# EAGLE design v6 (EAGLE 7.3.0)

## Sheet 1 of 2
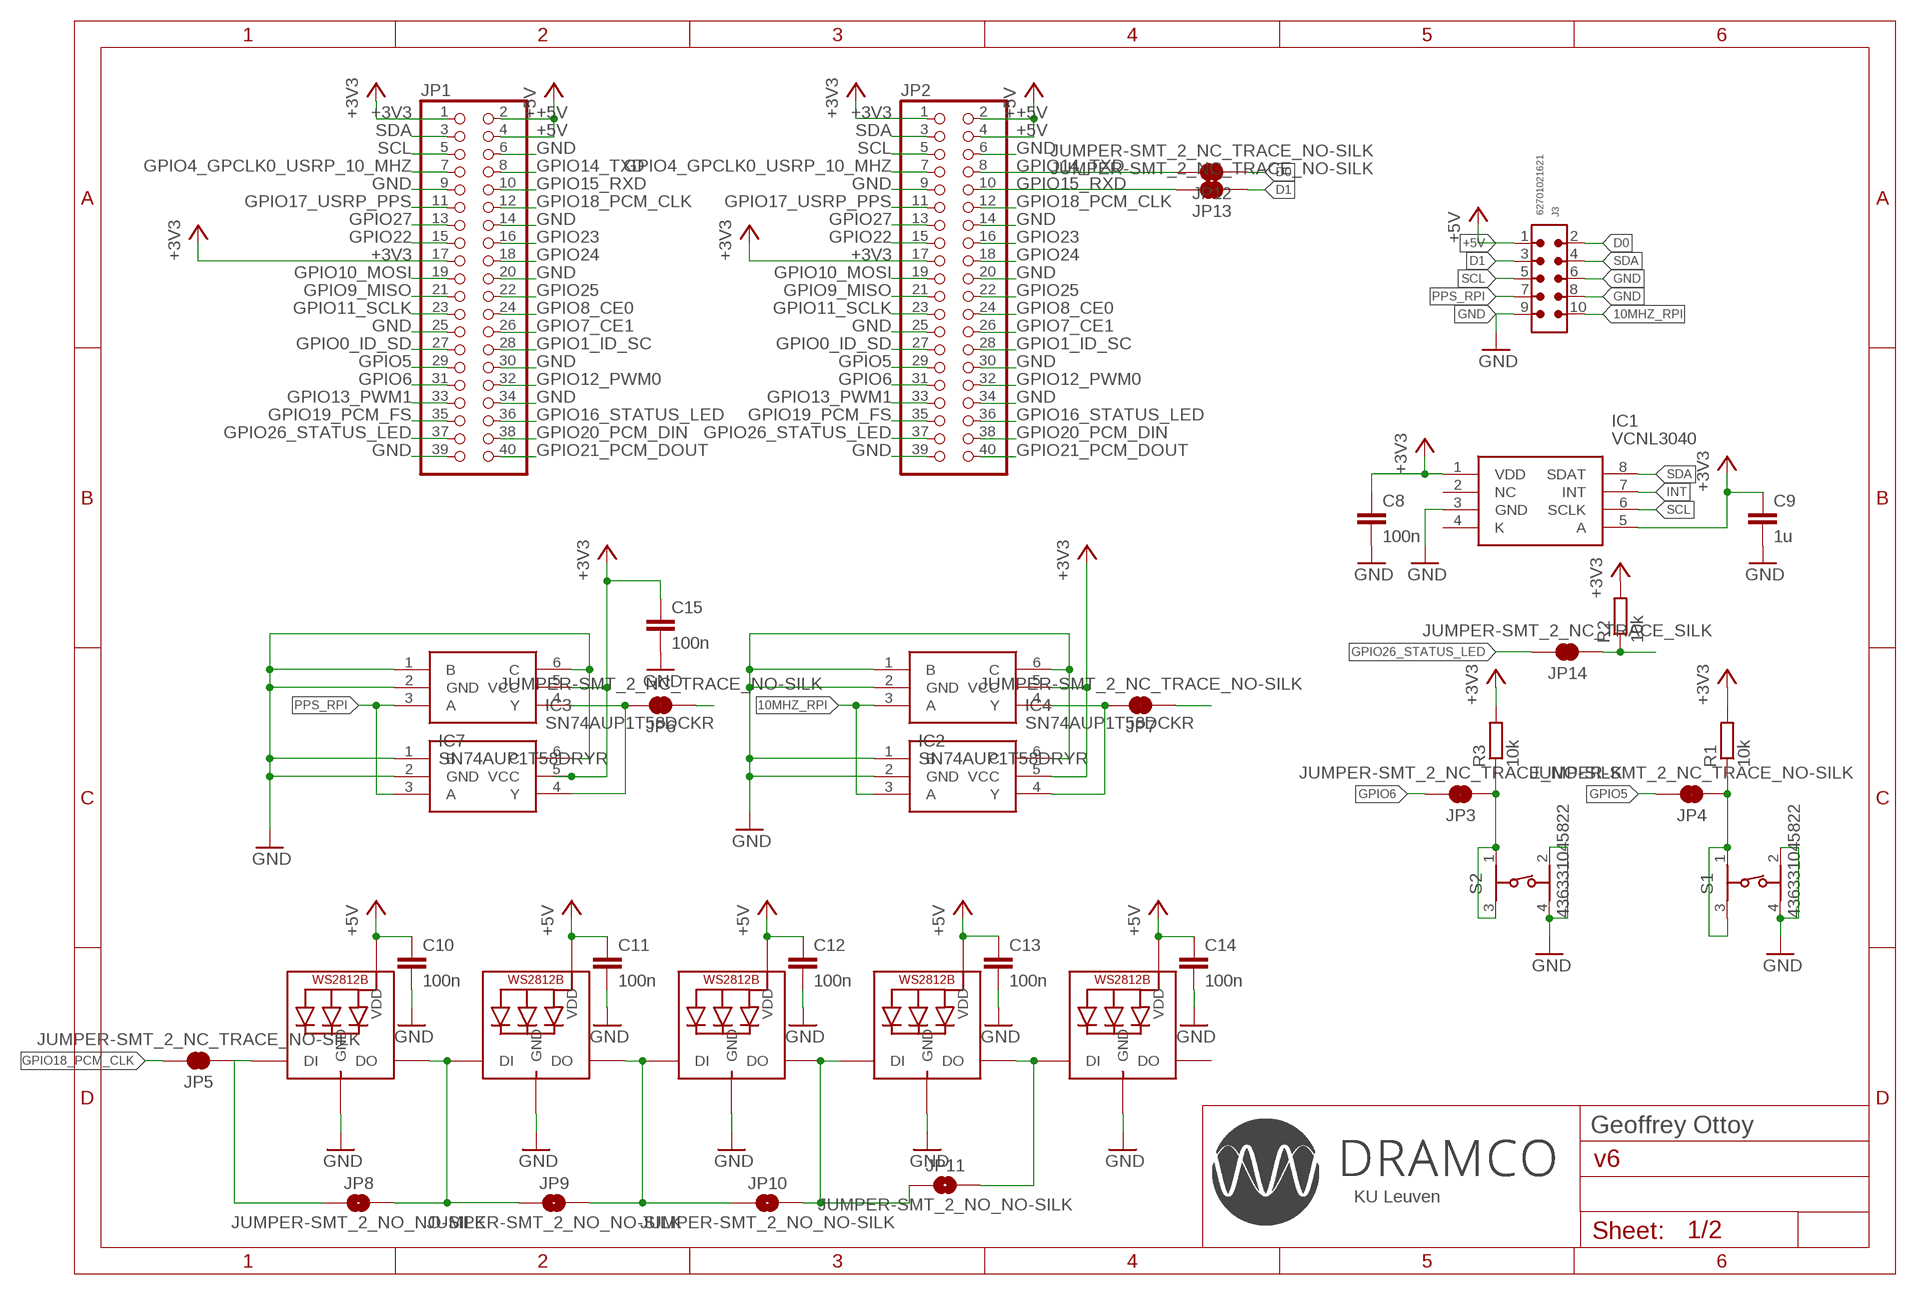
[diagram p0: schematic, sheet 1]

### Parts
C8  100n  C-EUC0603  [C0603]
C9  1u  C-EUC0603  [C0603]
C10  100n  C-EUC0603  [C0603]
C11  100n  C-EUC0603  [C0603]
C12  100n  C-EUC0603  [C0603]
C13  100n  C-EUC0603  [C0603]
C14  100n  C-EUC0603  [C0603]
C15  100n  C-EUC0603  [C0603]
IC1  VCNL3040  [SON108P200X400X115-8N]
IC2  SN74AUP1T58DRYR  [SON50P100X145X60-6N]
IC3  SN74AUP1T58DCKR  [SOT65P210X110-6N]
IC4  SN74AUP1T58DCKR  [SOT65P210X110-6N]
IC7  SN74AUP1T58DRYR  [SON50P100X145X60-6N]
J3  62701021621  6270XX21621_62701021621  [62701021621]
JP1  PINHD-2X20  [2X20]
JP2  PINHD-2X20/90  [2X20/90]
JP3  JUMPER-SMT_2_NC_TRACE_NO-SILK  [SMT-JUMPER_2_NC_TRACE_NO-SILK]
JP4  JUMPER-SMT_2_NC_TRACE_NO-SILK  [SMT-JUMPER_2_NC_TRACE_NO-SILK]
JP5  JUMPER-SMT_2_NC_TRACE_NO-SILK  [SMT-JUMPER_2_NC_TRACE_NO-SILK]
JP6  JUMPER-SMT_2_NC_TRACE_NO-SILK  [SMT-JUMPER_2_NC_TRACE_NO-SILK]
JP7  JUMPER-SMT_2_NC_TRACE_NO-SILK  [SMT-JUMPER_2_NC_TRACE_NO-SILK]
JP8  JUMPER-SMT_2_NO_NO-SILK  [SMT-JUMPER_2_NO_NO-SILK]
JP9  JUMPER-SMT_2_NO_NO-SILK  [SMT-JUMPER_2_NO_NO-SILK]
JP10  JUMPER-SMT_2_NO_NO-SILK  [SMT-JUMPER_2_NO_NO-SILK]
JP11  JUMPER-SMT_2_NO_NO-SILK  [SMT-JUMPER_2_NO_NO-SILK]
JP12  JUMPER-SMT_2_NC_TRACE_NO-SILK  [SMT-JUMPER_2_NC_TRACE_NO-SILK]
JP13  JUMPER-SMT_2_NC_TRACE_NO-SILK  [SMT-JUMPER_2_NC_TRACE_NO-SILK]
JP14  JUMPER-SMT_2_NC_TRACE_SILK  [SMT-JUMPER_2_NC_TRACE_SILK]
LED1  WS2812B5050  [WS2812B]
LED2  WS2812B5050  [WS2812B]
LED3  WS2812B5050  [WS2812B]
LED4  WS2812B5050  [WS2812B]
LED5  WS2812B5050  [WS2812B]
R1  10k  R-EU_R0603  [R0603]
R2  10k  R-EU_R0603  [R0603]
R3  10k  R-EU_R0603  [R0603]
S1  436331045822  [4363X10458XX]
S2  436331045822  [4363X10458XX]

### Nets
10MHZ_RPI: IC2.3(A) IC4.3(A) J3.10
+3V3: C8.1 C9.1 C15.1 IC1.1(VDD) IC1.5(A) IC2.5(VCC) IC3.5(VCC) IC4.5(VCC) IC7.5(VCC) JP1.1 JP1.17 JP2.1 JP2.17 R1.2 R2.2 R3.2
+5V: C10.1 C11.1 C12.1 C13.1 C14.1 J3.1 JP1.2 JP1.4 JP2.2 JP2.4 LED1.1-VDD(VDD) LED2.1-VDD(VDD) LED3.1-VDD(VDD) LED4.1-VDD(VDD) LED5.1-VDD(VDD)
D0: J3.2 JP12.1
D1: J3.3 JP13.1
GND: C8.2 C9.2 C10.2 C11.2 C12.2 C13.2 C14.2 C15.2 IC1.3(GND) IC2.1(B) IC2.2(GND) IC2.6(C) IC3.1(B) IC3.2(GND) IC3.6(C) IC4.1(B) IC4.2(GND) IC4.6(C) IC7.1(B) IC7.2(GND) IC7.6(C) J3.6 J3.8 J3.9 JP1.6 JP1.9 JP1.14 JP1.20 JP1.25 JP1.30 JP1.34 JP1.39 JP2.6 JP2.9 JP2.14 JP2.20 JP2.25 JP2.30 JP2.34 JP2.39 LED1.3-GND(GND) LED2.3-GND(GND) LED3.3-GND(GND) LED4.3-GND(GND) LED5.3-GND(GND) S1.2 S1.4 S2.2 S2.4 ; also sheet 2
GPIO0_ID_SD: JP1.27 JP2.27
GPIO1_ID_SC: JP1.28 JP2.28
GPIO4_GPCLK0_USRP_10_MHZ: JP1.7 JP2.7 JP7.1
GPIO5: JP1.29 JP2.29 JP4.2
GPIO6: JP1.31 JP2.31 JP3.2
GPIO7_CE1: JP1.26 JP2.26
GPIO8_CE0: JP1.24 JP2.24
GPIO9_MISO: JP1.21 JP2.21
GPIO10_MOSI: JP1.19 JP2.19
GPIO11_SCLK: JP1.23 JP2.23
GPIO12_PWM0: JP1.32 JP2.32
GPIO13_PWM1: JP1.33 JP2.33
GPIO14_TXD: JP1.8 JP2.8 JP12.2
GPIO15_RXD: JP1.10 JP2.10 JP13.2
GPIO16_STATUS_LED: JP1.36 JP2.36
GPIO17_USRP_PPS: JP1.11 JP2.11 JP6.1
GPIO18_PCM_CLK: JP1.12 JP2.12 JP5.2
GPIO19_PCM_FS: JP1.35 JP2.35
GPIO20_PCM_DIN: JP1.38 JP2.38
GPIO21_PCM_DOUT: JP1.40 JP2.40
GPIO22: JP1.15 JP2.15
GPIO23: JP1.16 JP2.16
GPIO24: JP1.18 JP2.18
GPIO25: JP1.22 JP2.22
GPIO26_STATUS_LED: JP1.37 JP2.37 JP14.2
GPIO27: JP1.13 JP2.13
INT: IC1.7(INT) JP14.1 R2.1
N$1: IC3.4(Y) IC7.4(Y) JP6.2
N$3: IC2.4(Y) IC4.4(Y) JP7.2
N$5: JP3.1 R3.1 S2.1 S2.3
N$6: JP8.2 JP9.1 LED1.2-DOUT(DO) LED2.4-DIN(DI)
N$7: JP9.2 JP10.1 LED2.2-DOUT(DO) LED3.4-DIN(DI)
N$8: JP10.2 JP11.1 LED3.2-DOUT(DO) LED4.4-DIN(DI)
N$9: JP11.2 LED4.2-DOUT(DO) LED5.4-DIN(DI)
N$10: JP4.1 R1.1 S1.1 S1.3
N$17: JP5.1 JP8.1 LED1.4-DIN(DI)
PPS_RPI: IC3.3(A) IC7.3(A) J3.7
SCL: IC1.6(SCLK) J3.5 JP1.5 JP2.5 ; also sheet 2
SDA: IC1.8(SDAT) J3.4 JP1.3 JP2.3 ; also sheet 2
Unconnected: IC1.2(NC) IC1.4(K) LED5.2-DOUT(DO)

### Notes on the sheet
- Geoffrey Ottoy
- KU Leuven

## Sheet 2 of 2
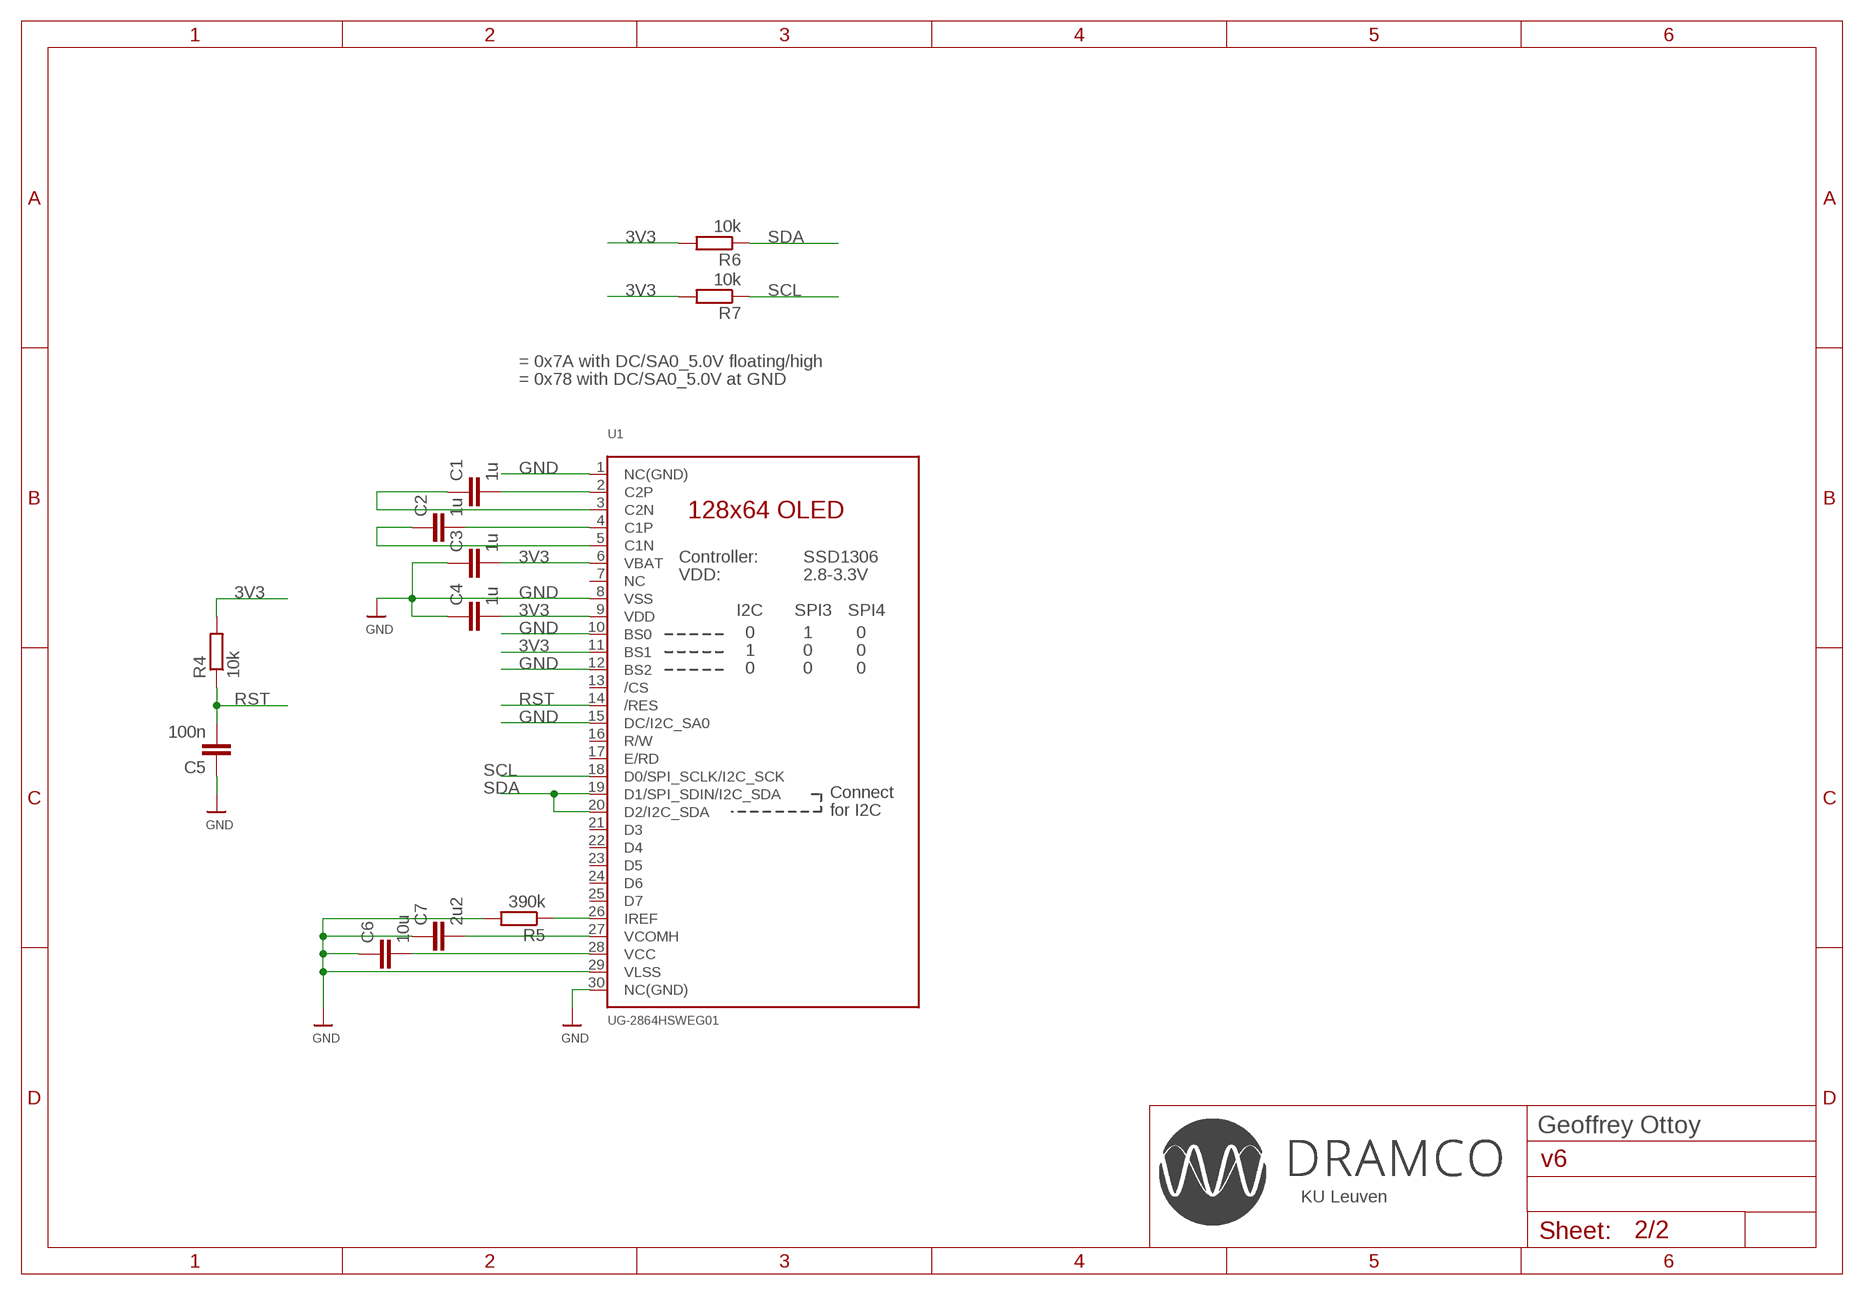
[diagram p1: schematic, sheet 2]

### Parts
C1  1u  C-EUC0603  [C0603]
C2  1u  C-EUC0603  [C0603]
C3  1u  C-EUC0603  [C0603]
C4  1u  C-EUC0603  [C0603]
C5  100n  C-EUC0603  [C0603]
C6  10u  C-EUC0603  [C0603]
C7  2u2  C-EUC0603  [C0603]
R4  10k  R-EU_R0603  [R0603]
R5  390k  R-EU_R0603  [R0603]
R6  10k  R-EU_R0603  [R0603]
R7  10k  R-EU_R0603  [R0603]
U1  UG-2864HSWEG01  DISP_OLED_UG-2864HSWEG010.96"  [UG-2864HSWEG01_0.96IN_WRAPAROUND]

### Nets
3V3: C3.2 C4.2 R4.2 R6.2 R7.2 U1.6(VBAT) U1.9(VDD) U1.11(BS1)
GND: C3.1 C4.1 C5.1 C6.1 C7.1 R5.2 U1.1(NC(GND)) U1.8(VSS) U1.10(BS0) U1.12(BS2) U1.15(DC/I2C_SA0) U1.29(VLSS) U1.30(NC(GND)) ; also sheet 1
N$11: C1.2 U1.2(C2P)
N$16: C6.2 U1.28(VCC)
N$19: C7.2 U1.27(VCOMH)
N$104: R5.1 U1.26(IREF)
N$112: C1.1 U1.3(C2N)
N$113: C2.2 U1.4(C1P)
N$114: C2.1 U1.5(C1N)
RST: C5.2 R4.1 U1.14(/RES)
SCL: R7.1 U1.18(D0/SPI_SCLK/I2C_SCK) ; also sheet 1
SDA: R6.1 U1.19(D1/SPI_SDIN/I2C_SDA) U1.20(D2/I2C_SDA) ; also sheet 1
Unconnected: U1.7(NC) U1.13(/CS) U1.16(R/W) U1.17(E/RD) U1.21(D3) U1.22(D4) U1.23(D5) U1.24(D6) U1.25(D7)

### Notes on the sheet
- = 0x7A with DC/SA0_5.0V floating/high
- = 0x78 with DC/SA0_5.0V at GND
- Geoffrey Ottoy
- KU Leuven

## Library data of the parts
C1-C15 = rcl:C-EU: CAPACITOR, European symbol
IC1 = SamacSys_Parts:VCNL3040: VISHAY - VCNL3040 - Proximity Sensor, I2C, 300 mm, QFN, 8 Pins, 2.5 V, 3.6 V Source: Datasheet; DESCRIPTION: VISHAY - VCNL3040 - Proximity Sensor, I2C, 300 mm, QFN, 8 Pins, 2.5 V, 3.6 V; HEIGHT: 1.15mm; MANUFACTURER_NAME: Vishay; MANUFACTURER_PART_NUMBER: VCNL3040; MOUSER_PART_NUMBER: 78-VCNL3040; MOUSER_PRICE-STOCK: https://www.mouser.co.uk/ProductDetail/Vishay-Semiconductors/VCNL3040?qs=bZr6mbWTK5m90GodUNdcvA%3D%3D
IC2 IC7 = SamacSys_Parts:SN74AUP1T58DRYR: SINGLE-SUPPLY VOLTAGE-LEVEL TRANSLATOR WITH NINE CONFIGURABLE GATE LOGIC FUNCTIONS Source: Datasheet <http://www.ti.com/lit/gpn/sn74aup1t58>; DESCRIPTION: SINGLE-SUPPLY VOLTAGE-LEVEL TRANSLATOR WITH NINE CONFIGURABLE GATE LOGIC FUNCTIONS; HEIGHT: mm; MANUFACTURER_NAME: Texas Instruments; MANUFACTURER_PART_NUMBER: SN74AUP1T58DRYR
IC3 IC4 = SamacSys_Parts:SN74AUP1T58DCKR: Single-Supply Voltage Translator Source: Datasheet <http://www.ti.com/lit/gpn/sn74aup1t58>; DESCRIPTION: Single-Supply Voltage Translator; HEIGHT: 1.1mm; MANUFACTURER_NAME: Texas Instruments; MANUFACTURER_PART_NUMBER: SN74AUP1T58DCKR
J3 = Eagle_WR-BHD (rev22c):6270XX21621_62701021621: WR-BHD 1.27 mm Male Box Header KIND PROPERTIES: Pitch 1.27 mm Gender:Male MATERIAL PROPERTIES: Insulator Material Nylon 9T Insulator Flammability Rating UL94 V-0 Insulator Color Black Contact Material Brass Contact Plating Gold over Nickel GENERAL INFORMATION: Operating Temperature -40 up to +105 °C Working Voltage 50 V (AC) Withstanding Voltage 500 V (AC) Contact Resistance 20 mΩ RISO 1000 MΩ CERTIFICATION: UL Approval E323964 <https://www.we-online.com/catalog/media/o375404v209%20Family_WR-BHD_6270xx21621.jpg> Details see: https://www.we-online.com/catalog/en/WR_BHD_1_27_MM_MALE_BOX_HEADER Created by Ella Wu 2021-08-24 2021 (C) Würth Elektronik; CONTACT-RESISTANCE: 20mOhm; DATASHEET-URL: https://www.we-online.com/redexpert/spec/62701021621?ae; GENDER: Male; IR: 1A; LENGTH: 12.7mm; MOUNT: THT; PART-NUMBER: 62701021621; PINS: 10; PITCH: 1.27mm; TYPE: Straight; WORKING-VOLTAGE: 50V(AC)
JP1 JP2 = pinhead:PINHD-2X20: PIN HEADER
JP3-JP7 JP12-JP14 = SparkFun-Jumpers:JUMPER-SMT_2_NC_TRACE: Normally closed trace jumper This jumper has a trace between two pads so it's normally closed (NC). Use a razor knife to open the connection. For best results follow the IPC guidelines for cutting traces: Cutout at least 0.063 mm (0.005 in). Remove all loose material to clean up the cut area. Seal the cut with an approved epoxy. Reapply solder to reclose the connection.
JP8-JP11 = SparkFun-Jumpers:JUMPER-SMT_2_NO: Normally open jumper This jumper has two pads in close proximity to each other. Apply solder to close the connection. Round pads are easier to solder for beginners, but are a lot larger. SparkFun Product that uses the round pads: SparkFun EL Sequencer <https://www.sparkfun.com/products/12781>
LED1-LED5 = adafruit:WS2812B
R1-R7 = rcl:R-EU_: RESISTOR, European symbol
S1 S2 = Eagle_WS-TASU (rev21a):436331045822: WS-TASU SMT Tact Switch with Boss Design 4.7x3.5 mm side push MATERIAL PROPERTIES Cover Material:Stainless Steel PROPERTIES Actuator Material:PA46 Actuator Flammability Rating: UL94 HB Actuator Color: Black; White Frame Material: PA46 Frame Flammability: UL94 HB Frame Color:Black;White Contact Material Stainless Steel Contact Plating Silver Terminal Material Copper Alloy Terminal Plating Silver VR 12 V (DC) Contact Resistance Initial 100 mΩ Contact Resistance After Life Test 1 Ω RISO 100 MΩ Withstanding Voltage 250 V (AC) Washable No Qty. 3300 Mechanical Properties Stroke:0.25 mm; 0.3 mm GENERAL INFORMATION Operating Temperature -40 up to +85 °C Washable:No PACKAGING PROPERTIES Packaging Tape and Reel <https://www.we-online.com/catalog/media/o61089v209%20Family_WS_TUS_Normal_SMD_J-Bend_4363x10458xx_pf2.jpg> Details see: https://www.we-online.com/catalog/en/TASU_3_5X4_7_SMD_SIDE_PUSH_BOSS_DESIGN/ Updated by Yingchun, Shan 2020-02-17 2020(C) Wurth Elektronik; DATASHEET-URL: https://www.we-online.com/catalog/datasheet/436331045822.pdf; H: 1.65mm; OPERATION-FORCE: 220g; PART-NUMBER: 436331045822; QTY: 3300
U1 = microbuilder:DISP_OLED_UG-2864HSWEG01: UG-2864HSWEG01 OLED display Both 1.3" and 0.96" models share the same FPC tab footprint, only the screen dimensions vary.

## Board
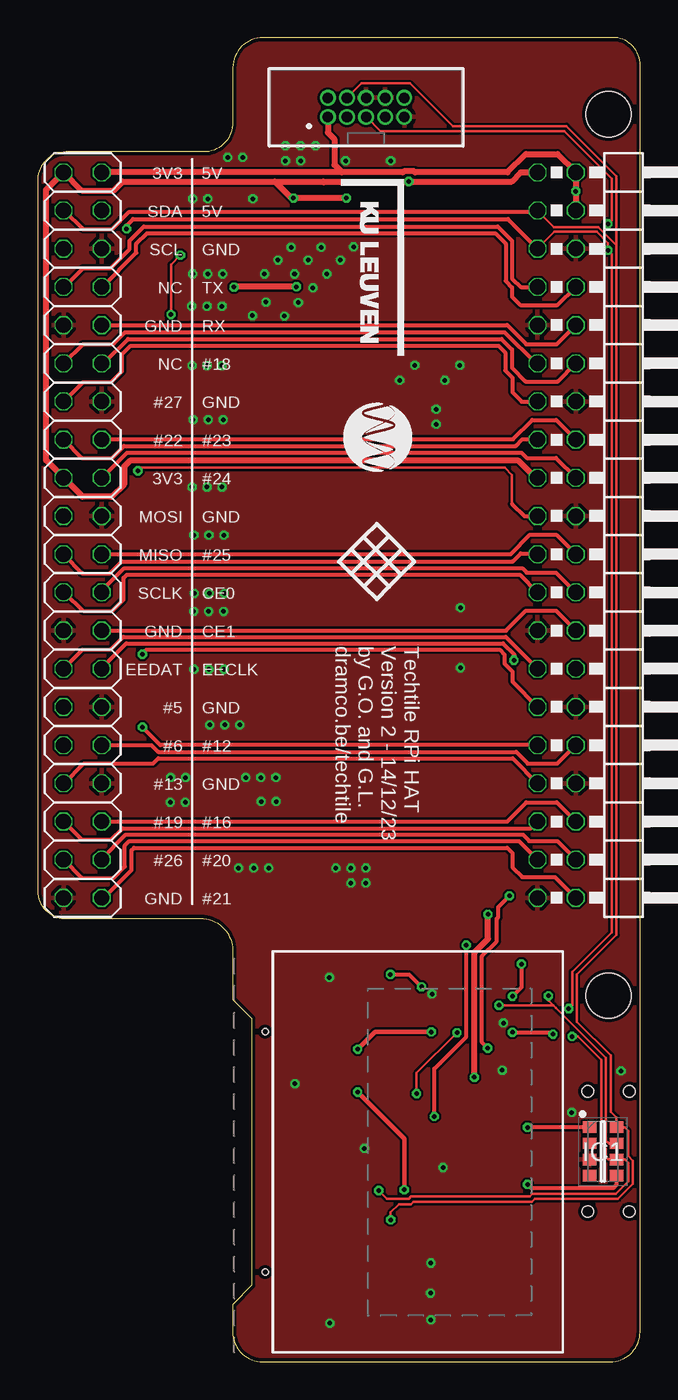
[diagram p2: board, top side]
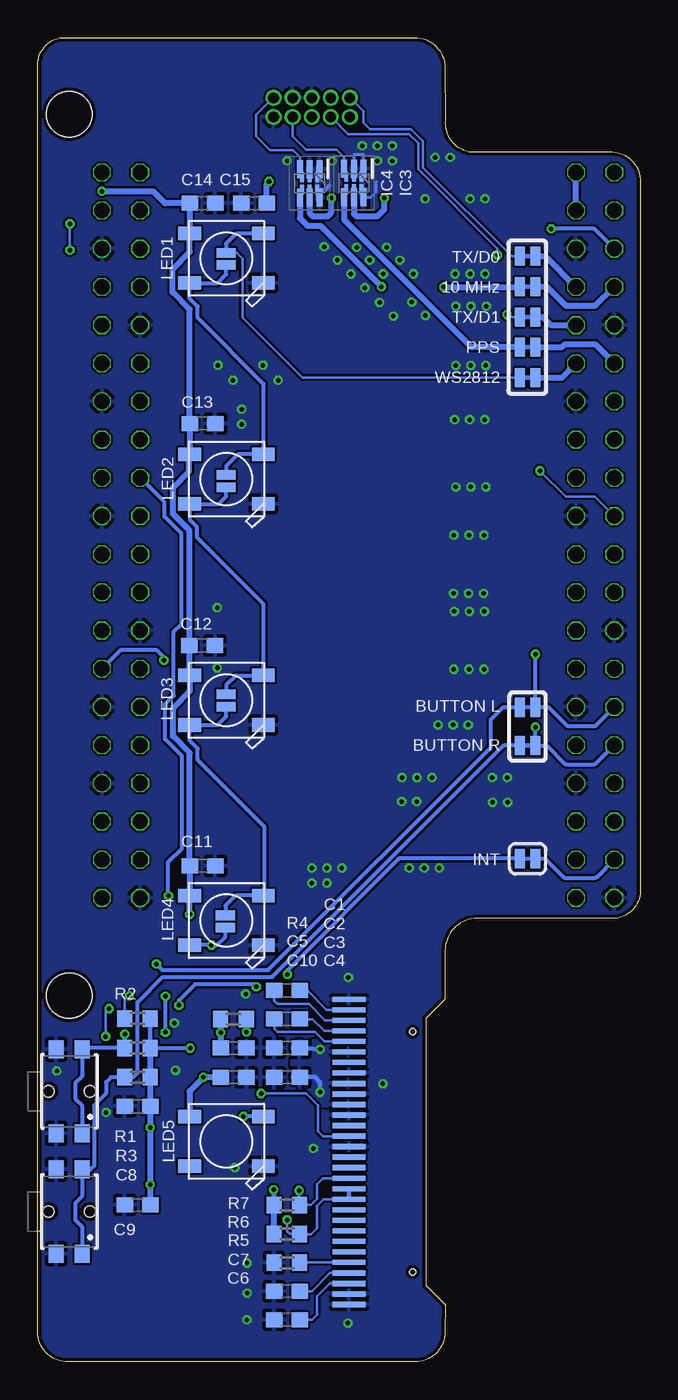
[diagram p3: board, bottom side, seen from below]

Size 40.1 x 88.09 mm. Coordinates in mm from the lower left corner, seen from the top.
Outline: 0,31.13 arc90 2.13,29.51 10.84,29.51 arc-90 12.98,27.36 12.98,24.13 14.26,22.84 14.26,5.09 12.97,3.81 12.98,2 arc90 14.98,0 38.09,0 arc90 40.09,2 40.09,86.09 arc90 38.46,88.09 15.01,88.09 arc89 12.98,86.09 12.97,82.64 12.97,82.62 arc-90 11.22,80.49 1.87,80.49 arc91 0,78.5 0,31.13
Copper layers (1*16): Top 0.035mm / dielectric 1.5mm / Bottom 0.035mm
Design rules "SeeedStudio_2layer_DRU_no_angle_20140221 *": minimum track width 6mil, minimum drill 12mil, track to track 6mil, track to pad 6mil, pad to pad 6mil, via to via 6mil, smd to smd 0mil, copper to edge 10mil, drill to drill 10mil, minimum pad ring 1mil, minimum via ring 6mil, stop-mask expansion 2mil, vias tented up to drill 100mil, thermal gap 10mil
Holes 3 mm at 38,83 38,24.36

### Footprints (pad centres in the part's own frame; a part is rotated, then mirrored left to right if it is on the bottom)
C0603 = smd 1.1 x 1: 1 -0.85,0; 2 0.85,0
SON108P200X400X115-8N = smd 0.9 x 0.75: 1 -0.9,1.612; 2 -0.9,0.538; 3 -0.9,-0.538; 4 -0.9,-1.612; 5 0.9,-1.612; 6 0.9,-0.538; 7 0.9,0.538; 8 0.9,1.612
SON50P100X145X60-6N = smd 0.66 x 0.254: 1 -0.406,0.508; 2 -0.406,0; 3 -0.406,-0.508; 4 0.406,-0.508; 5 0.406,0; 6 0.406,0.508
SOT65P210X110-6N = smd 1.2 x 0.4: 1 -0.95,0.65; 2 -0.95,0; 3 -0.95,-0.65; 4 0.95,-0.65; 5 0.95,0; 6 0.95,0.65
62701021621 = drill 0.7 pad 1.05: 1 -2.54,-0.635; 2 -2.54,0.635; 3 -1.27,-0.635; 4 -1.27,0.635; 5 0,-0.635; 6 0,0.635; 7 1.27,-0.635; 8 1.27,0.635; 9 2.54,-0.635; 10 2.54,0.635
2X20 = drill 1.016 octagon: 1 -24.13,-1.27; 2 -24.13,1.27; 3 -21.59,-1.27; 4 -21.59,1.27; 5 -19.05,-1.27; 6 -19.05,1.27; 7 -16.51,-1.27; 8 -16.51,1.27; 9 -13.97,-1.27; 10 -13.97,1.27; 11 -11.43,-1.27; 12 -11.43,1.27; 13 -8.89,-1.27; 14 -8.89,1.27; 15 -6.35,-1.27; 16 -6.35,1.27; 17 -3.81,-1.27; 18 -3.81,1.27; 19 -1.27,-1.27; 20 -1.27,1.27; 21 1.27,-1.27; 22 1.27,1.27; 23 3.81,-1.27; 24 3.81,1.27; 25 6.35,-1.27; 26 6.35,1.27; 27 8.89,-1.27; 28 8.89,1.27; 29 11.43,-1.27; 30 11.43,1.27; 31 13.97,-1.27; 32 13.97,1.27; 33 16.51,-1.27; 34 16.51,1.27; 35 19.05,-1.27; 36 19.05,1.27; 37 21.59,-1.27; 38 21.59,1.27; 39 24.13,-1.27; 40 24.13,1.27
2X20/90 = drill 1.016 octagon: 1 -24.13,-6.35; 2 -24.13,-3.81; 3 -21.59,-6.35; 4 -21.59,-3.81; 5 -19.05,-6.35; 6 -19.05,-3.81; 7 -16.51,-6.35; 8 -16.51,-3.81; 9 -13.97,-6.35; 10 -13.97,-3.81; 11 -11.43,-6.35; 12 -11.43,-3.81; 13 -8.89,-6.35; 14 -8.89,-3.81; 15 -6.35,-6.35; 16 -6.35,-3.81; 17 -3.81,-6.35; 18 -3.81,-3.81; 19 -1.27,-6.35; 20 -1.27,-3.81; 21 1.27,-6.35; 22 1.27,-3.81; 23 3.81,-6.35; 24 3.81,-3.81; 25 6.35,-6.35; 26 6.35,-3.81; 27 8.89,-6.35; 28 8.89,-3.81; 29 11.43,-6.35; 30 11.43,-3.81; 31 13.97,-6.35; 32 13.97,-3.81; 33 16.51,-6.35; 34 16.51,-3.81; 35 19.05,-6.35; 36 19.05,-3.81; 37 21.59,-6.35; 38 21.59,-3.81; 39 24.13,-6.35; 40 24.13,-3.81
SMT-JUMPER_2_NC_TRACE_NO-SILK = smd 0.66 x 1.27: 1 -0.521,0; 2 0.521,0
SMT-JUMPER_2_NO_NO-SILK = smd 0.635 x 1.27: 1 -0.406,0; 2 0.406,0
SMT-JUMPER_2_NC_TRACE_SILK = smd 0.66 x 1.27: 1 -0.521,0; 2 0.521,0
WS2812B = smd 1.5 x 0.9: 1-VDD 2.45,-1.65; 2-DOUT 2.45,1.65; 3-GND -2.45,1.65; 4-DIN -2.45,-1.65
R0603 = smd 1 x 1.1: 1 -0.85,0; 2 0.85,0
4363X10458XX = smd 1.2 x 1: 1 2.8,0.85; 2 2.8,-0.85; 3 -2.8,0.85; 4 -2.8,-0.85 | hole 0.75: 0,1.375; 0,-1.375
UG-2864HSWEG01_0.96IN_WRAPAROUND = smd 0.35 x 2.2 bottom: 1 -10.15,-1.2; 2 -9.45,-1.2; 3 -8.75,-1.2; 4 -8.05,-1.2; 5 -7.35,-1.2; 6 -6.65,-1.2; 7 -5.95,-1.2; 8 -5.25,-1.2; 9 -4.55,-1.2; 10 -3.85,-1.2; 11 -3.15,-1.2; 12 -2.45,-1.2; 13 -1.75,-1.2; 14 -1.05,-1.2; 15 -0.35,-1.2; 16 0.35,-1.2; 17 1.05,-1.2; 18 1.75,-1.2; 19 2.45,-1.2; 20 3.15,-1.2; 21 3.85,-1.2; 22 4.55,-1.2; 23 5.25,-1.2; 24 5.95,-1.2; 25 6.65,-1.2; 26 7.35,-1.2; 27 8.05,-1.2; 28 8.75,-1.2; 29 9.45,-1.2; 30 10.15,-1.2 | hole 0.4: -8,-5.45; 8,-5.45

### Placement (x,y rotation side)
C1  23.51,24.71 0 bottom
C2  23.51,22.81 0 bottom
C3  23.51,20.89 0 bottom
C4  23.51,18.93 0 bottom
C5  27.06,20.89 180 bottom
C6  23.51,2.82 0 bottom
C7  23.51,4.71 0 bottom
C8  33.45,17 180 bottom
C9  33.45,10.44 180 bottom
C10  27.06,18.93 0 bottom
C11  29.12,33 0 bottom
C12  29.15,47.65 0 bottom
C13  29.12,62.42 0 bottom
C14  29.12,77.08 0 bottom
C15  25.7,77.08 180 bottom
IC1  37.62,14 0 top
IC2  22,78.4 270 bottom
IC3  19.05,78.42 270 bottom
IC4  22,78.4 270 bottom
IC7  19.05,78.42 270 bottom
J3  21.86,83.45 0 top
JP1  3,55 270 top
JP2  39.62,55 270 top
JP3  7.5,41 0 bottom
JP4  7.5,43.55 0 bottom
JP5  7.5,65.47 0 bottom
JP6  7.5,67.5 180 bottom
JP7  7.5,71.53 180 bottom
JP8  27.56,73.37 270 bottom
JP9  27.56,58.6 270 bottom
JP10  27.56,44 270 bottom
JP11  27.61,29.29 270 bottom
JP12  7.5,73.55 0 bottom
JP13  7.5,69.5 0 bottom
JP14  7.5,33.48 0 bottom
LED1  27.54,73.41 180 bottom
LED2  27.54,58.73 180 bottom
LED3  27.54,44.02 180 bottom
LED4  27.54,29.36 180 bottom
LED5  27.54,14.67 180 bottom
R1  33.45,20.89 0 bottom
R2  33.45,22.85 0 bottom
R3  33.45,18.93 0 bottom
R4  27.06,22.81 0 bottom
R5  23.51,6.6 180 bottom
R6  23.51,8.52 180 bottom
R7  23.51,10.44 180 bottom
S1  38,18 270 bottom
S2  38,10 270 bottom
U1  20.59,13.97 270 top

### Tracks (layer width: path | path; a pad name or v marks a point on that pad's centre or on a via)
3V3  (via drill 0.3)
  Top 0.305: v26.2,21.95 22.45,21.95 v21.3,20.8 | v24.4,11.45 24.4,14.85 v21.3,17.95
  Bottom 0.305: R4.2 26.21,21.94 v26.2,21.95 | v21.3,20.8 22.64,20.9 C3.2 | R7.2 24.36,11.41 v24.4,11.45 | v21.3,17.95 21.3,18.6 21.65,18.95 22.64,18.95 C4.2
  Bottom 0.406: R6.2 R7.2
  pour Bottom: 19.45,20.95 19.45,16.95 21.45,17 23.2,18.75 23.2,21.4 19.5,21.4
10MHZ_RPI
  Bottom 0.152: IC2.3 22.65,78.95 IC4.3 22.65,80.15 23.1,80.6 24.62,80.6 25.55,81.53 25.55,82.97 24.43,84.09 J3.10
+3V3  (via drill 0.3)
  Top 0.152: 32.61,15.61 v32.6,15.6
  Top 0.254: IC1.5 38.52,11.77 38.3,11.55 32.85,11.55 v32.6,11.8 | IC1.1 32.61,15.61 | v29.95,20.88 29.57,21.25 29.57,27 30.55,27.98 30.55,29.48 30.65,29.57 30.65,30.25 v31.4,31
  Top 0.406: 15.8,78.53 5.65,78.53 5.05,77.92 2.95,77.92 1.75,79.13 JP1.1 0.57,77.97 0.57,59.98 JP1.17 2.99,57.55 4.92,57.55 5.75,58.38 5.75,59.55 6.15,59.95 32,59.95 33.14,58.81 JP2.17 | 15.8,78.53 19,78.53 | 19,78.53 v24.7,78.53 31.55,78.53 32.15,79.12 JP2.1 | 19.05,78.47 19,78.53 | v20.55,77.42 v17.02,77.42 16.9,77.42 15.8,78.53
  Bottom 0.152: IC4.5 IC2.5 | IC7.5 IC3.5
  Bottom 0.254: R1.2 v29.96,20.89 v29.95,20.88 | v31.4,31 31.4,33.25 30.5,34.15 30.5,40.3 31.62,41.42 31.62,43.75 31.05,44.33 31.05,48.58 30.52,49.1 30.52,55.1 31.65,56.23 31.65,57.19 JP2.17
  Bottom 0.305: R1.2 R2.2
  Bottom 0.406: C9.1 v32.6,11.8 v32.6,15.6 C8.1 R3.2 R1.2 | IC2.5 22,76.4 21.8,76.2 20.8,76.2 20.55,76.45 v20.55,77.42 | v17.02,77.42 17.02,76.67 17.5,76.2 18.88,76.2 19.05,76.38 IC7.5 | C15.1 24.85,78.38 v24.7,78.53
+5V  (via drill 0.3)
  Top 0.406: v29.07,18.93 29.07,27.24 29.98,28.15 v29.98,29.77 | JP2.4 v35.81,77.88 JP2.2 34.59,80.35 32.5,80.35 31.28,79.13 25.14,79.13 25.07,79.2 24.38,79.2 24.3,79.12 20.25,79.12 | 20.25,79.12 JP1.2 | J3.1 19.32,81.78 19.75,81.35 19.75,79.62 20.25,79.12
  Bottom 0.406: C10.1 v29.07,18.93 30,18 30,16.34 LED5.1-VDD | v29.98,29.77 LED4.1-VDD 29.98,31.02 C11.1 29.98,40.5 31.1,41.62 31.1,43.5 29.98,44.62 LED3.1-VDD 29.98,47.63 C12.1 30,55.3 31.1,56.4 31.1,58.17 30.02,59.25 30.02,60.34 LED2.1-VDD C13.1 29.98,70 31.12,71.15 31.12,72.7 29.98,73.85 LED1.1-VDD 29.98,75.07 C14.1 31.62,77.08 32.42,77.88 v35.81,77.88 | JP1.4 JP1.2
D0
  Bottom 0.152: JP12.1 8.55,73.55 14.45,79.45 14.45,81.2 15.25,82 18,82 18.43,82.42 18.43,83.19 J3.2
D1  (via drill 0.3)
  Top 0.152: v8.88,69.67 8.88,73 v9.5,73.62
  Bottom 0.152: JP13.1 8.7,69.5 v8.88,69.67 | v9.5,73.62 9.5,74.05 14.78,79.33 14.78,81.08 15.38,81.67 19.45,81.67 J3.3
GND  (via drill 0.3)
  Bottom 0.152: IC3.6 18.4,77.88 IC7.6 18.54,77.82 18.38,77.65 18.38,77.53 18.3,77.45 17.95,77.45 17.6,77.8 17.6,78.47 17.55,78.53 | 18.52,78.83 IC7.1 18.4,78.97 18.4,80.33 18.43,80.35 19.05,80.35 IC7.2 19.05,79.67 | IC2.1 21.49,79.21 IC4.1 | IC4.6 21.35,77.85 IC2.6
  Bottom 0.254: IC2.6 20.96,77.99 20.7,78.25
  other vias: 28.15,46.17 26.52,62.38 26.52,63.38 28.15,50.17 21.02,74.17 20.15,73.3 19.25,72.38 18.32,71.45 17.35,70.47 16.43,69.58 18.88,74.15 18,73.3 15.1,72.38 16.88,74.15 16,73.3 17.1,72.38 15.2,70.5 14.3,69.6 20.5,79.9 12.28,70.22 11.28,70.22 10.25,70.22 10.32,72.38 11.32,72.38 12.32,72.38 17.5,79.9 16.5,79.9 16.5,80.9 17.5,80.9 18.5,80.9 23.5,79.9 10.32,77.38 14.32,77.38 11.32,77.38 13.65,80.12 12.65,80.12 10.28,66.28 11.28,66.28 12.28,66.28 10.35,62.67 11.35,62.67 12.35,62.67 25.1,66.3 24.1,65.3 27.1,65.3 28.1,66.3 10.28,58.2 11.28,58.2 12.28,58.2 10.4,55 11.4,55 12.4,55 10.43,51.12 11.43,51.12 12.43,51.12 10.38,49.92 11.38,49.92 12.38,49.92 10.4,46.08 11.4,46.08 12.4,46.08 11.45,42.38 12.45,42.38 13.85,38.88 14.85,38.88 15.85,38.88 13.45,42.38 9.85,38.88 8.85,38.88 8.82,37.23 9.82,37.23 14.88,37.27 15.88,37.27 15.38,32.85 14.38,32.85 13.38,32.85 19.85,32.85 20.85,32.85 21.85,32.85 20.85,31.85 21.85,31.85 19.43,25.57 26.25,24.48 31,22.55 30.93,19.4 26.98,12.93 21.75,14.2 17.12,18.5 19.45,2.58 26.18,2.8 26.15,4.58 26.18,6.58 35.55,16.6 38.83,19.35
  pour Bottom (rank 5): -1,-2.63 54.63,-2.63 54.63,89.81 -1,89.81
  pour Top: 62.5,92 62.5,-4.59 -3,-4.59 -3,92
GPIO0_ID_SD
  Top 0.254: JP1.27 3,47.38 4.85,47.38 5.7,48.23 31.16,48.23 JP2.27
GPIO1_ID_SC  (via drill 0.3)
  Top 0.254: JP1.28 4.27,46.17 5.9,47.8 30.98,47.8 31.73,47.05 31.73,46.7 v31.7,46.67
  Bottom 0.254: v31.7,46.67 31.7,46.88 32.17,47.35 34.58,47.35 JP2.28
GPIO4_GPCLK0_USRP_10_MHZ
  Top 0.254: JP1.7 1.78,71.51 3.02,72.75 4.85,72.75 6.12,74.03 6.12,74.58 7.08,75.53 30.62,75.53 31.57,74.58 31.57,72.08 32.15,71.5 JP2.7
  Bottom 0.406: JP7.1 6.22,71.53 4.95,70.25 2.99,70.25 JP1.7
GPIO5  (via drill 0.3)
  Top 0.254: v6.97,47.08 6.97,47.1 7.25,47.38 30.75,47.38 31.07,47.05 31.07,46.45 31.6,45.92 31.6,45.24 JP2.29
  Bottom 0.254: JP1.29 3,42.3 4.85,42.3 6.1,43.55 JP4.2 v6.98,47.07 v6.97,47.08
GPIO6  (via drill 0.3)
  Top 0.254: JP2.31 8.17,41.03 v6.97,42.23
  Bottom 0.254: JP1.31 3.01,39.75 4.97,39.75 6.22,41 JP3.2 v6.98,42.22 v6.97,42.23
GPIO7_CE1
  Top 0.254: JP1.26 31.18,48.65 32.5,49.98 34.49,49.98 JP2.26
GPIO8_CE0
  Top 0.254: 4.34,51.12 4.34,51.37 5.78,52.8 32.25,52.8 32.55,52.5 34.51,52.5 JP2.24
  Top 0.305: JP1.24 4.34,51.12
GPIO9_MISO
  Top 0.254: JP1.21 1.73,53.7 2.98,52.45 4.8,52.45 5.6,53.25 31.62,53.25 32.15,53.77 33.23,53.77 JP2.21
GPIO10_MOSI  (via drill 0.3)
  Top 0.152: v6.67,59.27 6.88,59.48 31.1,59.48 31.57,59 31.57,57.08
  Top 0.254: 31.57,57.08 32.4,56.25 33.26,56.25 JP2.19
  Bottom 0.152: 1.77,56.27 1.77,56.3 3.02,57.55 4.95,57.55 v6.67,59.27
  Bottom 0.254: JP1.19 1.77,56.27
GPIO11_SCLK
  Top 0.254: JP1.23 1.78,51.19 3.02,49.95 4.97,49.95 5.72,50.7 5.72,52.15 5.95,52.38 32.09,52.38 JP2.23
GPIO12_PWM0
  Top 0.254: JP1.32 7.57,41.03 8.03,40.58 31.85,40.58 32.62,39.8 34.59,39.8 JP2.32
GPIO13_PWM1
  Top 0.254: JP1.33 1.76,38.49 3.08,39.8 7.67,39.8 8.03,40.15 31.61,40.15 JP2.33
GPIO14_TXD
  Top 0.254: JP1.8 4.31,71.51 6.58,73.78 6.58,74.38 7.28,75.08 30.45,75.08 31.15,74.38 31.15,71.9 31.57,71.47 31.57,70.85 32.12,70.3 34.6,70.3 JP2.8
  Bottom 0.406: JP12.2 6.31,73.55 JP1.8
GPIO15_RXD
  Top 0.254: JP1.10 31.25,68.97 32.52,67.7 34.55,67.7 JP2.10
  Bottom 0.406: JP13.2 6.48,69.5 5.95,68.97 JP1.10
GPIO16_STATUS_LED
  Top 0.254: JP1.36 31.25,35.95 32.52,37.23 34.54,37.23 JP2.36
GPIO17_USRP_PPS
  Top 0.254: JP1.11 1.75,66.43 3.02,67.7 5.03,67.7 5.83,68.5 31.07,68.5 33.15,66.43 JP2.11
  Bottom 0.406: JP1.11 3,67.7 4.92,67.7 5.03,67.7 5.22,67.5 JP6.1
GPIO18_PCM_CLK
  Top 0.254: JP1.12 4.41,66.43 6.03,68.05 30.88,68.05 31.57,67.35 31.57,66.12 32.48,65.22 34.61,65.22 JP2.12
  Bottom 0.406: 4.3,66.4 JP1.12 5.23,65.47 JP5.2
GPIO19_PCM_FS
  Top 0.254: JP1.35 2.92,34.75 4.9,34.75 5.65,35.5 32.83,35.5 JP2.35
GPIO20_PCM_DIN
  Top 0.254: JP1.38 4.27,33.47 5.88,35.08 32.3,35.08 32.73,34.65 34.58,34.65 JP2.38
GPIO21_PCM_DOUT
  Top 0.254: JP1.40 4.39,30.87 6.25,32.73 6.25,34.02 6.42,34.2 31.25,34.2 31.6,33.85 31.6,32.9 32.25,32.25 34.44,32.25 JP2.40
GPIO22
  Top 0.254: JP1.15 2.95,60.12 4.95,60.12 5.75,60.92 31.82,60.92 32.27,61.38 33.25,61.38 JP2.15
GPIO23
  Top 0.254: JP1.16 4.27,61.37 31.64,61.37 32.92,62.65 34.52,62.65 JP2.16
GPIO24
  Top 0.254: JP1.18 4.29,58.81 5.95,60.48 32.2,60.48 32.55,60.12 34.5,60.12 JP2.18
GPIO25
  Top 0.254: JP1.22 31.48,53.73 32.77,55.02 34.52,55.02 JP2.22
GPIO26_STATUS_LED
  Top 0.254: JP1.37 2.95,32.2 5.05,32.2 5.8,32.95 5.8,34.35 6.1,34.65 32.03,34.65 JP2.37
  Bottom 0.254: JP14.2 6.43,33.48 arc45 6.25,33.4 5.05,32.2 3.04,32.2 arc-45 2.87,32.27 JP1.37
GPIO27
  Top 0.254: JP1.13 3.02,65.17 4.9,65.17 5.62,65.9 5.62,67.03 6.2,67.6 30.68,67.6 31.12,67.15 31.12,65.95 31.6,65.47 31.6,64.5 32.23,63.88 33.26,63.88 JP2.13
INT  (via drill 0.3)
  Top 0.152: v30.7,23.73 34.33,23.73 | 34.33,23.73 34.49,23.56 37.83,20.23 37.83,14.7 38,14.53 38.51,14.53 IC1.7 | v34,24.35 34,24.05 34.33,23.73
  Top 0.254: v23.48,25.77 24.73,25.77 v25.55,24.95
  Bottom 0.152: R2.1 34.3,24.05 v34,24.35
  Bottom 0.254: JP14.1 16.05,33.48 23.48,26.05 v23.48,25.77 | v25.55,24.95 25.73,25.12 29.62,25.12 30.7,24.05 v30.7,23.73
N$1
  Bottom 0.152: IC3.4 19.7,77.88 IC7.4
  Bottom 0.406: IC3.4 19.7,75.97 11.22,67.5 JP6.2
N$3  (via drill 0.3)
  Top 0.406: v17.23,71.53 13.1,71.53 v13.07,71.5
  Bottom 0.152: IC4.4 22.65,77.85 IC2.4
  Bottom 0.406: IC4.4 22.65,76.08 22.15,75.58 21.27,75.58 v17.23,71.53 | v13.07,71.5 8.05,71.5 JP7.2
N$5
  Bottom 0.254: S2.1 37.15,9 37.6,9.45 37.6,10.55 37.15,11 S2.3 36.6,12.8 36.35,13.05 36.35,17.05 35.55,17.85 35.55,18.6 35.22,18.93 R3.1 33.74,18.93 33.45,19.23 33.45,23.93 31.77,25.6 24.5,25.6 9.1,41 JP3.1
N$6
  Bottom 0.254: JP9.1 27.55,59.01 27.55,59.6 26.77,60.38 LED2.4-DIN 25.05,60.38 25.05,65.05 29.45,69.45 29.45,70.2 29.98,70.72 LED1.2-DOUT 28.14,71.76 27.55,72.35 27.55,72.95 JP8.2
N$7
  Bottom 0.254: LED3.4-DIN 25.17,45.67 | JP10.1 27.55,45.02 26.91,45.67 25.17,45.67 | JP9.2 27.55,57.58 28.05,57.08 LED2.2-DOUT 29.95,57.05 29.95,56 29.5,55.55 29.5,54.85 25.07,50.42 25.07,45.58 25.17,45.67
N$8
  Bottom 0.254: 25.09,31.02 LED4.4-DIN | 25.09,31.02 26.93,31.02 27.6,30.35 JP11.1 | JP10.2 27.55,42.95 28.13,42.37 LED3.2-DOUT 30,42.35 30,41.35 29.45,40.8 29.45,40.05 25,35.6 25,31 25.02,31.02 25.09,31.02
N$9  (via drill 0.3)
  Top 0.254: v26.4,16.32 26.4,19.5 28.52,21.62 v28.52,27.73
  Bottom 0.254: LED5.4-DIN v26.4,16.32 | LED4.2-DOUT 29.98,27.73 v28.52,27.73 28.15,27.73 27.6,28.27 27.6,28.88 JP11.2
N$10  (via drill 0.3)
  Top 0.254: v32.2,26.48 32.2,24.93 v31.6,24.32 | v31.6,21.93 34.17,21.93 v34.3,21.8
  Bottom 0.254: S1.1 37.15,17.05 37.6,17.5 37.6,18.55 37.15,19 S1.3 37.06,20.89 R1.1 v34.3,21.8 | 7.9,43.58 JP4.1 9.1,43.55 9.95,42.73 9.95,40.88 24.75,26.07 31.8,26.07 v32.2,26.48 | v31.6,24.32 v31.6,21.93
N$11
  Bottom 0.152: U1.2 20.87,23.42 22.15,24.7 C1.2
N$16
  Bottom 0.152: U1.28 20.63,5.22 21.5,4.35 21.5,3.15 21.85,2.8 22.64,2.8 C6.2
N$17
  Bottom 0.152: JP8.1 26.85,73.78 26.48,73.4 26.48,69.47 24,67 23.4,66.4 22.47,65.47 JP5.1
  Bottom 0.254: LED1.4-DIN 25.62,75.06 26.89,75.06 27.57,74.38 27.57,73.79 JP8.1
  Bottom 0.406: 25.05,75.05 25.61,75.05 25.62,75.06
N$19
  Bottom 0.152: C7.2 21.85,4.7 20.63,5.92 U1.27
N$104
  Bottom 0.152: U1.26 22.66,6.62 R5.1
N$112
  Bottom 0.152: U1.3 20.97,22.72 22.05,23.8 24.15,23.8 24.36,24.01 C1.1
N$113
  Bottom 0.152: U1.4 21.02,22.02 21.8,22.8 C2.2
N$114
  Bottom 0.152: U1.5 21.02,21.32 21.65,21.95 24.15,21.95 24.35,22.15 24.35,22.8 C2.1
PPS_RPI
  Bottom 0.152: IC7.3 19.7,78.97 IC3.3 19.7,80.12 20.2,80.62 22.23,80.62 23.13,81.53 J3.7
RST  (via drill 0.3)
  Top 0.152: v25.23,17.85 25.23,19.21 v27.91,21.9
  Bottom 0.152: U1.14 21.12,15.02 21.45,15.35 21.45,17.05 22.25,17.85 v25.23,17.85
  Bottom 0.406: R4.1 v27.91,21.9 27.91,21.38 C5.2
SCL  (via drill 0.3)
  Top 0.152: v22.7,11.4 23.25,10.85 24.7,10.85 24.85,11 32.75,11 32.92,11.18 38.48,11.18 39.3,12 39.3,13.25 39.09,13.46 IC1.6 37.99,13.46 37.83,13.62 37.83,14.18 37.5,14.5 37.5,20.1 35.95,21.65 v35.58,21.65 | JP2.5 34.4,75.17 37.2,75.17 37.95,74.42 v37.95,73.95 38.2,73.7 38.2,28.57 35.58,25.95 35.58,23.73 v35.35,23.5 | J3.5 21.88,82.82 22.82,81.88 35.05,81.88 38.2,78.72 38.2,75.95 v37.95,75.7
  Top 0.254: v5.92,75.38 5.92,75.6 6.35,76.03 31.3,76.03 JP2.5
  Bottom 0.152: U1.18 19.41,12.2 21.1,12.2 21.5,11.8 21.5,10.85 21.91,10.44 R7.1 22.7,10.48 v22.7,11.4 | 37.95,74.1 v37.95,73.95 v37.95,75.7 | v35.58,21.65 35.58,23.27 v35.35,23.5
  Bottom 0.254: JP1.5 3.05,75.38 v5.92,75.38
SDA  (via drill 0.3)
  Top 0.152: v23.5,9.45 23.5,9.95 24.05,10.5 24.85,10.5 25,10.65 32.9,10.65 33.1,10.85 38.62,10.85 39.62,11.85 39.62,13.38 39.3,13.7 39.3,15.38 39.08,15.6 IC1.8 38.52,16.28 38.15,16.65 38.15,20.38 35.9,22.62 35.9,25.77 38.52,28.4 38.52,74.3 | 38.52,74.3 37.33,75.5 34.37,75.5 JP2.3 | J3.4 21.55,85.05 24.77,85.05 27.62,82.2 35.2,82.2 38.52,78.88 38.52,74.3
  Top 0.254: JP1.3 1.78,76.59 3.02,75.35 4.95,75.35 6.1,76.5 33.19,76.5 JP2.3
  Bottom 0.152: U1.20 21.08,10.82 21.5,10.4 21.5,8.9 21.9,8.5 22.64,8.5 R6.1 23.32,8.52 23.5,8.7 v23.5,9.45
  Bottom 0.305: U1.20 U1.19

### Text on the board
tNames: 3V3 | 5V | SDA | 5V | SCL | GND | NC | TX | GND | RX | NC | #18 | #27 | GND | #22 | #23 | 3V3 | #24 | MOSI | GND | MISO | #25 | SCLK | CE0 | GND | CE1 | Techtile RPi HAT / Version 2 - 14/12/23 / by G.O. and G.L. / dramco.be/techtile | EEDAT | EECLK | #5 | GND | #6 | #12 | #13 | GND | #19 | #16 | #26 | #20 | GND | #21
bNames: TX/D0 | 10 MHz | TX/D1 | PPS | WS2812 | BUTTON L | BUTTON R | INT